# Altium schematic sheet input module.SchDoc
size 508 x 241 mm
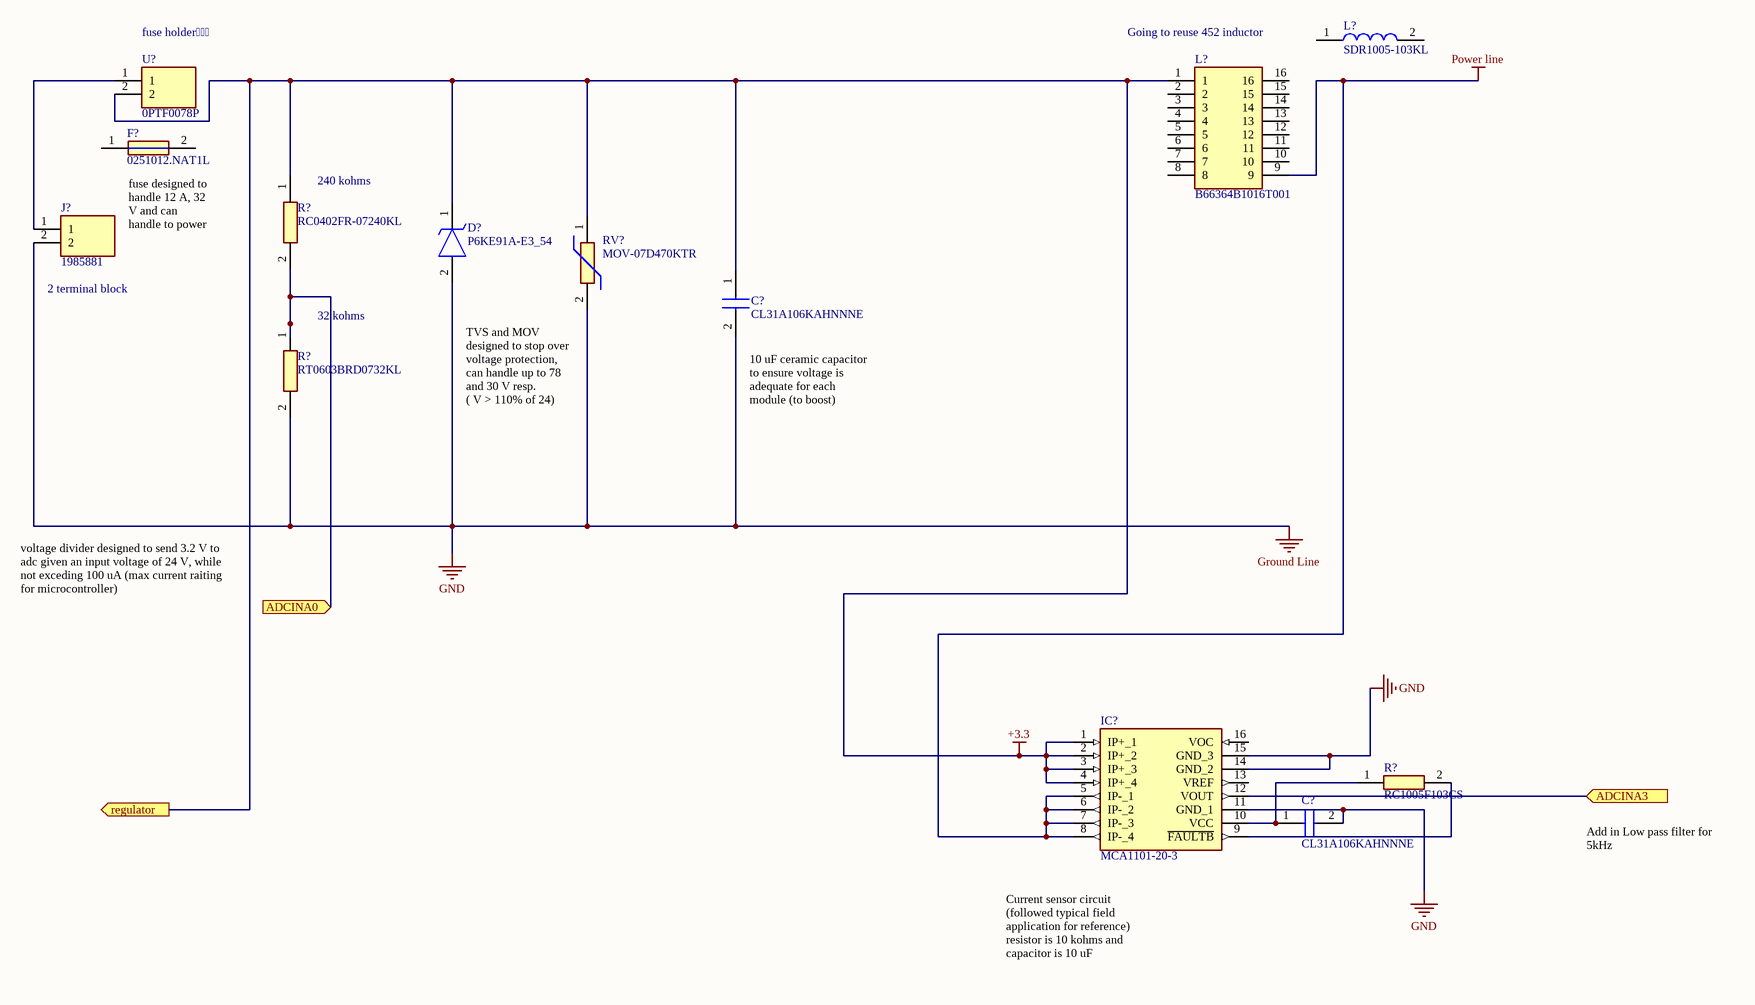
[diagram p0: input module.SchDoc]

## Parts
(Parts that share a designator on the sheet are numbered #1, #2 ... from top to bottom, then left to right.)
C?#1  CL31A106KAHNNNE  [CAPC3216X180N]
C?#2  CL31A106KAHNNNE  [CAPC3216X180N]
D?  P6KE91A-E3_54  [DIOAD1910W86L670D310]
F?  0251012.NAT1L  [0251012NAT1L]
IC?  MCA1101-20-3  [SOIC127P1031X264-16N]
J?  1985881  [1985881]
L?#1  SDR1005-103KL  [SDR1005103KL]
L?#2  B66364B1016T001  [B66364B1016T001]
R?#1  RC0402FR-07240KL  [RESC1005X40N]
R?#2  RT0603BRD0732KL  [RESC1608X55N]
R?#3  RC1005F103CS  [RESC1005X40N]
RV?  MOV-07D470KTR  [MOV07D470KTR]
U?  0PTF0078P  [0PTF0078P]

## Ports
ADCINA0 (in), ADCINA3 (in), regulator (out)

## Nets
+3.3: C?#1.1 D?.1(K) IC?.1(IP+_1) IC?.2(IP+_2) IC?.3(IP+_3) IC?.4(IP+_4) L?#2.1 R?#1.1 RV?.1 U?.2 ; port regulator
GND: C?#1.2 C?#2.2 D?.2(A) IC?.11(GND_1) IC?.14(GND_2) IC?.15(GND_3) J?.2 R?#2.2 RV?.2  [also labelled Ground Line]
Power line: IC?.5(IP-_1) IC?.6(IP-_2) IC?.7(IP-_3) IC?.8(IP-_4) L?#2.9
ADCINA0: R?#1.2 R?#2.1 ; port ADCINA0
ADCINA3: IC?.12(VOUT) ; port ADCINA3
NetC?#2_1: C?#2.1 IC?.10(VCC) R?#3.1
NetIC?_9: IC?.9(~{FAULTB}) R?#3.2
NetJ?_1: J?.1 U?.1

Not connected (* = marked no-connect by the designer): F? 1 2; IC? 13(VREF) 16(VOC); L?#1 1 2; L?#2 2 3 4 5 6 7 8 10 11 12 13 14 15 16

## Notes on the sheet
- (near U?) fuse holder
- (near L?#2) Going to reuse 452 inductor
- (near R?#1) 240 kohms
- (near F?) fuse designed to handle 12 A, 32 V and can handle to power
- (near J?) 2 terminal block
- (near R?#2) 32 kohms
- (near RV?) TVS and MOV designed to stop over voltage protection, can handle up to 78 and 30 V resp.
  ( V > 110% of 24)
- (near C?#1) 10 uF ceramic capacitor to ensure voltage is adequate for each module (to boost)
- voltage divider designed to send 3.2 V to adc given an input voltage of 24 V, while not exceding 100 uA (max current raiting for microcontroller)
- Add in Low pass filter for 5kHz
- Current sensor circuit (followed typical field application for reference) resistor is 10 kohms and capacitor is 10 uF

## Library data of the parts
C?#1 C?#2 = CL31A106KAHNNNE: Capacitor; Manufacturer_Name: Samsung Electro-Mechanics; Datasheet Link: https://datasheet.datasheetarchive.com/originals/distributors/Datasheets_SAMA/8c86add0e95aa125c91e23e767429ce6.pdf; Height: 1.8mm; Manufacturer_Part_Number: CL31A106KAHNNNE; Mouser Part Number: 187-CL31A106KAHNNNE; Mouser Price/Stock: https://www.mouser.co.uk/ProductDetail/Samsung-Electro-Mechanics/CL31A106KAHNNNE?qs=349EhDEZ59rSHw4%2FqTnHBg%3D%3D; Arrow Part Number: CL31A106KAHNNNE; Arrow Price/Stock: https://www.arrow.com/en/products/cl31a106kahnnne/samsung-electro-mechanics?region=europe
D? = P6KE91A-E3_54: TVS Diode (Uni-directional); Manufacturer_Name: Vishay; Manufacturer_Part_Number: P6KE91A-E3/54; Datasheet Link: https://www.mouser.com/datasheet/2/427/p6ke-1767850.pdf
F? = 0251012.NAT1L: Fuse; Manufacturer_Name: LITTELFUSE; Datasheet Link: https://www.jameco.com/Jameco/Products/ProdDS/1710451.pdf; Height: 2.8mm; Manufacturer_Part_Number: 0251012.NAT1L
IC? = MCA1101-20-3: Integrated Circuit; Manufacturer_Name: ACEINNA; Height: 2.64mm; Manufacturer_Part_Number: MCA1101-20-3; Mouser Part Number: 438-MCA1101-20-3; Mouser Price/Stock: https://www.mouser.co.uk/ProductDetail/ACEINNA/MCA1101-20-3?qs=PzGy0jfpSMs8efb76nV%2FyQ%3D%3D
J? = 1985881: Connector; Manufacturer_Name: Phoenix Contact; Datasheet Link: https://www.digikey.com/en/products/detail/phoenix-contact/1985881/2511015; Height: 13.9mm; Manufacturer_Part_Number: 1985881; Mouser Part Number: 651-1985881; Mouser Price/Stock: https://www.mouser.co.uk/ProductDetail/Phoenix-Contact/1985881?qs=YbgdthCBnKfqOEwK0VcNyQ%3D%3D; Arrow Part Number: 1985881; Arrow Price/Stock: https://www.arrow.com/en/products/1985881/phoenix-contact?region=nac
L?#1 = SDR1005-103KL: Inductor; Manufacturer_Name: Bourns; Datasheet Link: https://datasheet.datasheetarchive.com/originals/distributors/SFDatasheet-7/sf-000140402.pdf; Height: 5.3mm; Manufacturer_Part_Number: SDR1005-103KL; Mouser Part Number: 652-SDR1005-103KL; Mouser Price/Stock: https://www.mouser.co.uk/ProductDetail/Bourns/SDR1005-103KL/?qs=jraqILX6wiTcnNUTuCpcXw%3D%3D; Arrow Part Number: SDR1005-103KL; Arrow Price/Stock: https://www.arrow.com/en/products/sdr1005-103kl/bourns
L?#2 = B66364B1016T001: Inductor; Manufacturer_Name: TDK; Datasheet Link: https://product.tdk.com/system/files/dam/doc/product/ferrite/ferrite/ferrite-acc/data_sheet/80/db/fer/etd_39_20_13.pdf; Height: 35.5mm; Manufacturer_Part_Number: B66364B1016T001; Mouser Part Number: 871-B66364B1016T001; Mouser Price/Stock: https://www.mouser.co.uk/ProductDetail/EPCOS-TDK/B66364B1016T001?qs=w5o0Loj0u7OCD3bXX%252BmaPQ%3D%3D; Arrow Part Number: B66364B1016T001; Arrow Price/Stock: https://www.arrow.com/en/products/b66364b1016t001/epcos-tdk?region=europe
R?#1 = RC0402FR-07240KL: Resistor; Manufacturer_Name: YAGEO (PHYCOMP); Datasheet Link: https://datasheet.datasheetarchive.com/originals/distributors/Datasheets_SAMA/902f9e387b938f871d31120f5fc1d65e.pdf; Height: 0.4mm; Manufacturer_Part_Number: RC0402FR-07240KL; Mouser Part Number: 603-RC0402FR-07240KL; Mouser Price/Stock: https://www.mouser.co.uk/ProductDetail/YAGEO/RC0402FR-07240KL?qs=UOUeRUa%252B8Wk%2FVV3xbpEz8g%3D%3D; Arrow Part Number: RC0402FR-07240KL; Arrow Price/Stock: https://www.arrow.com/en/products/rc0402fr-07240kl/yageo
R?#2 = RT0603BRD0732KL: Resistor; Manufacturer_Name: YAGEO (PHYCOMP); Datasheet Link: https://www.mouser.com/datasheet/2/447/PYu-RT_1-to-0.01_RoHS_L_9-1222720.pdf; Height: 0.55mm; Manufacturer_Part_Number: RT0603BRD0732KL; Mouser Part Number: 603-RT0603BRD0732KL; Mouser Price/Stock: https://www.mouser.co.uk/ProductDetail/Yageo/RT0603BRD0732KL/?qs=bQfrgN9vNvx59w0%252BvAxCSQ%3D%3D
R?#3 = RC1005F103CS: Resistor; Manufacturer_Name: Samsung Electro-Mechanics; Datasheet Link: https://datasheet.datasheetarchive.com/originals/distributors/Datasheets-DGA22/1466507.pdf; Height: 0.4mm; Manufacturer_Part_Number: RC1005F103CS; Mouser Part Number: N/A; Mouser Price/Stock: https://www.mouser.com/Search/Refine.aspx?Keyword=N%2FA; Arrow Part Number: RC1005F103CS; Arrow Price/Stock: https://www.arrow.com/en/products/rc1005f103cs/samsung-electro-mechanics
RV? = MOV-07D470KTR: Varistor; Manufacturer_Name: Bourns; Datasheet Link: https://componentsearchengine.com/Datasheets/1/MOV-07D470KTR.pdf; Height: 11mm; Manufacturer_Part_Number: MOV-07D470KTR; Mouser Part Number: 652-MOV-07D470KTR; Mouser Price/Stock: https://www.mouser.co.uk/ProductDetail/Bourns/MOV-07D470KTR?qs=lgttKnAd%252B2CIK1rqnmjNIA%3D%3D; Arrow Part Number: MOV-07D470KTR; Arrow Price/Stock: https://www.arrow.com/en/products/mov-07d470ktr/bourns
U? = 0PTF0078P: Undefined or Miscellaneous; Manufacturer_Name: LITTELFUSE; Datasheet Link: https://media.digikey.com/pdf/Data%20Sheets/Littelfuse%20PDFs/PTF075_77_78.pdf; Height: 11.5mm; Manufacturer_Part_Number: 0PTF0078P; Mouser Part Number: 576-0PTF0078P; Mouser Price/Stock: https://www.mouser.co.uk/ProductDetail/Littelfuse/0PTF0078P?qs=Co4VkB5J4%2Fsczy6gG8s%2FsA%3D%3D; Arrow Part Number: 0PTF0078P; Arrow Price/Stock: https://www.arrow.com/en/products/0ptf0078p/littelfuse?region=nac